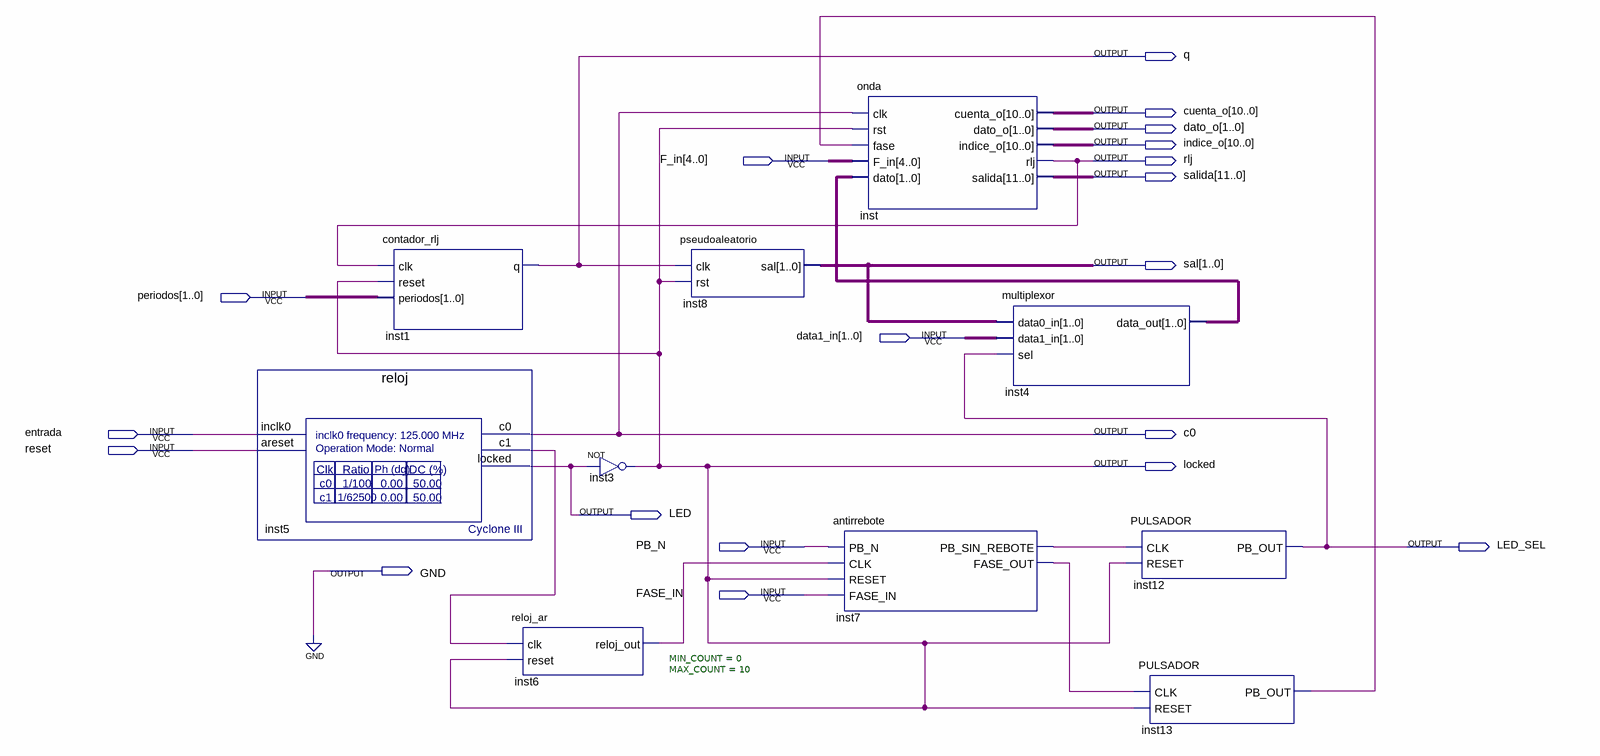
[diagram p0: schematic sheet]
// Quartus schematic moduladorSCH.bdf as structural Verilog: 10 symbols, 19 pins
module moduladorSCH (
  input  [4:0] F_in,
  input  [1:0] periodos,
  input  [1:0] data1_in,
  input  entrada,
  input  reset,
  input  PB_N,
  input  FASE_IN,
  output q,
  output [10:0] cuenta_o,
  output [1:0] dato_o,
  output [10:0] indice_o,
  output rlj,
  output [11:0] salida,
  output [1:0] sal,
  output c0,
  output locked,
  output LED,
  output LED_SEL,
  output GND
);

  wire inst5_c1, inst6_reloj_out, inst7_fase_out, inst7_pb_sin_rebote, inst13_pb_out;
  wire [1:0] inst4_data_out;

  reloj inst5 (.inclk0(entrada), .areset(reset), .c0(c0), .c1(inst5_c1), .locked(LED));
  contador_rlj inst1 (.clk(rlj), .reset(locked), .periodos(periodos), .q(q));
  reloj_ar #(.MIN_COUNT(0), .MAX_COUNT(10)) inst6 (.clk(inst5_c1), .reset(locked), .reloj_out(inst6_reloj_out));
  not inst3 (locked, LED);
  pseudoaleatorio inst8 (.clk(q), .rst(locked), .sal(sal));
  antirrebote inst7 (
    .PB_N(PB_N), .CLK(inst6_reloj_out), .RESET(locked), .FASE_IN(FASE_IN),
    .PB_SIN_REBOTE(inst7_pb_sin_rebote), .FASE_OUT(inst7_fase_out));
  onda inst (
    .clk(c0), .rst(locked), .fase(inst13_pb_out), .F_in(F_in), .dato(inst4_data_out), .cuenta_o(cuenta_o),
    .dato_o(dato_o), .indice_o(indice_o), .rlj(rlj), .salida(salida));
  multiplexor inst4 (.data0_in(sal), .data1_in(data1_in), .sel(LED_SEL), .data_out(inst4_data_out));
  PULSADOR inst12 (.CLK(inst7_pb_sin_rebote), .RESET(locked), .PB_OUT(LED_SEL));
  PULSADOR inst13 (.CLK(inst7_fase_out), .RESET(locked), .PB_OUT(inst13_pb_out));

  assign GND = 1'b0;
endmodule
